# Altium schematic sheet encoder.SchDoc: Encoder
size A3; DrawnBy: Mogens Groth Nicolaisen; DocumentNumber: 7; SheetNumber: 7; SheetTotal: 7
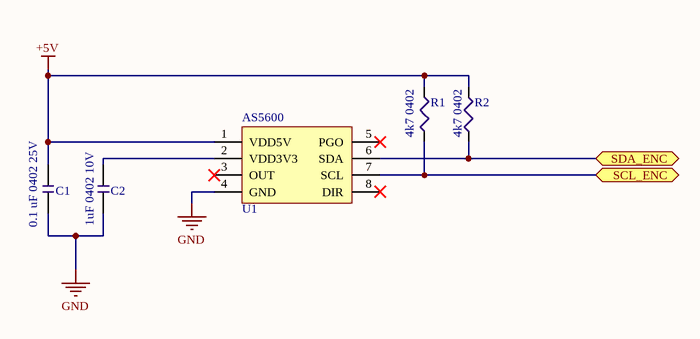
[diagram p0: encoder.SchDoc]

## Parts
C1  0.1 uF 0402 25V  [CAP_0402]
C2  1uF 0402 10V  [CAP_0402]
R1  4k7 0402  [RES_0402]
R2  4k7 0402  [RES_0402]
U1  AS5600  [AS5600_SOIC8]

## Ports
SCL_ENC (bidir), SDA_ENC (bidir)

## Nets
+5V: C1.2 R1.2 R2.2 U1.1(VDD5V)
GND: C1.1 C2.1 U1.4(GND)
SCL_ENC: R1.1 U1.7(SCL) ; port SCL_ENC
SDA_ENC: R2.1 U1.6(SDA) ; port SDA_ENC
NetC2_2: C2.2 U1.2(VDD3V3)

Not connected (* = marked no-connect by the designer): U1 3(OUT)* 5(PGO)* 8(DIR)*

## Notes on the sheet
- ON Development
- Title:
- Size:
- A3
- Drawn By:
- Date:
- Sheet
- of
- Revision:

## Library data of the parts
C1 = CMP-00061-4: 0.1UF 25V 10% X5R 0402; Mfg. Part Number: TMK105BJ104KV-F; Tolerance: 10%; Value: 0.1 uF; Voltage: 25V
C2 = CMP-00032-4: 1uF 0402 10V 10% X5R; Tolerance: 10 %; Value: 1 uF; Voltage: 10 V
R1 R2 = CMP-001-0029-3: RES SMD 4.7K OHM 1% 1/16W 0402; Mfg. Part Number: RC1005F472CS; Tolerance: 1; Case/Package: 0402; Power: 1/16W; Value: 4k7
U1 = CMP-00062-3: IC SENSOR MAG ROTARY 12BIT 8SOIC; Mfg. Part Number: AS5600-ASOT